# EAGLE design Adafruit_BNO08x (EAGLE 9.6.2)
COMPANY: ADAFRUIT INDUSTRIES; DRAWN: KTOWN; REV: A
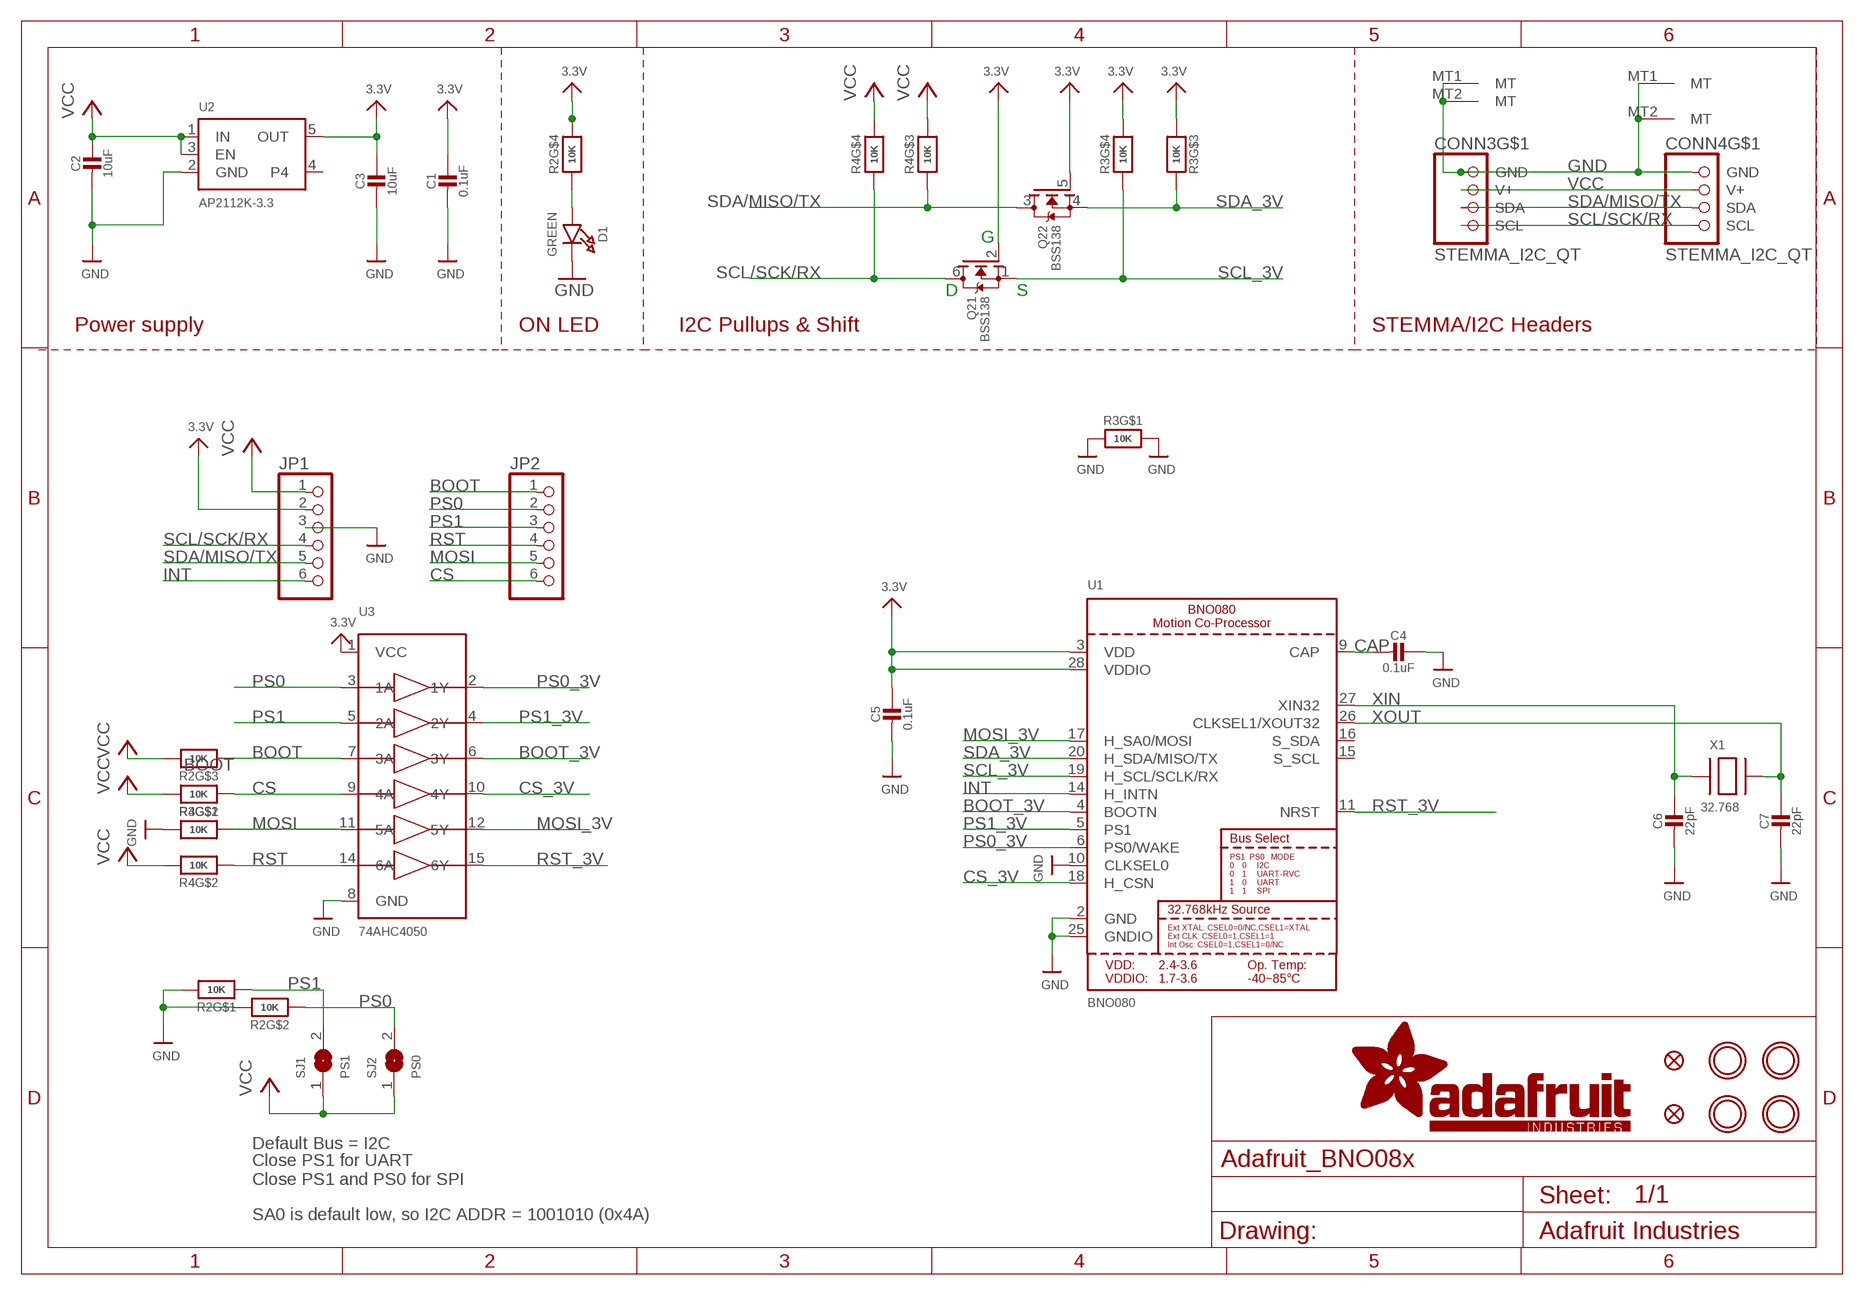
[diagram p0: schematic, sheet 1]

## Parts
C1  0.1uF  CAP_CERAMIC0603_NO  [0603-NO]
C2  10uF  CAP_CERAMIC0805-NOOUTLINE  [0805-NO]
C3  10uF  CAP_CERAMIC0805-NOOUTLINE  [0805-NO]
C4  0.1uF  CAP_CERAMIC0603_NO  [0603-NO]
C5  0.1uF  CAP_CERAMIC0603_NO  [0603-NO]
C6  22pF  CAP_CERAMIC0603_NO  [0603-NO]
C7  22pF  CAP_CERAMIC0603_NO  [0603-NO]
CONN3  STEMMA_I2C_QT  [JST_SH4]
CONN4  STEMMA_I2C_QT  [JST_SH4]
D1  GREEN  LED0603_NOOUTLINE  [CHIPLED_0603_NOOUTLINE]
FID3  FIDUCIAL_1MM  [FIDUCIAL_1MM]
FID4  FIDUCIAL_1MM  [FIDUCIAL_1MM]
JP1  HEADER-1X670MIL  [1X06_ROUND_70]
JP2  HEADER-1X670MIL  [1X06_ROUND_70]
Q2  BSS138  MOSFET-N_DUAL  [SOT363]
R2  10K  RESISTOR_4PACK  [RESPACK_4X0603]
R3  10K  RESISTOR_4PACK  [RESPACK_4X0603]
R4  10K  RESISTOR_4PACK  [RESPACK_4X0603]
SJ1  PS1  SOLDERJUMPER  [SOLDERJUMPER_ARROW_NOPASTE]
SJ2  PS0  SOLDERJUMPER  [SOLDERJUMPER_ARROW_NOPASTE]
U1  BNO080  [BNO080]
U2  AP2112K-3.3  VREG_SOT23-5  [SOT23-5]
U3  74AHC4050  74HC4050DTSSOP  [TSSOP16]
U$1  MOUNTINGHOLE2.5  [MOUNTINGHOLE_2.5_PLATED]
U$17  MOUNTINGHOLE2.5  [MOUNTINGHOLE_2.5_PLATED]
U$19  MOUNTINGHOLE2.5  [MOUNTINGHOLE_2.5_PLATED]
U$21  MOUNTINGHOLE2.5  [MOUNTINGHOLE_2.5_PLATED]
X1  32.768  XTAL-3.2X1.5  [XTAL3215]

## Nets
3.3V [lowpower]: C1.1 C3.1 C5.1 JP1.2 Q2.2(1:G) Q2.5(2:G) R2.5 R3.3 R3.5 U1.3(VDD) U1.28(VDDIO) U2.5(OUT) U3.1(VCC)
BOOT: JP2.1 R2.3 U3.7(3A)
BOOT_3V: U1.4(BOOTN) U3.6(3Y)
CAP: C4.2 U1.9(CAP)
CS: JP2.6 R4.1 U3.9(4A)
CS_3V: U1.18(H_CSN) U3.10(4Y)
GND [lowpower]: C1.2 C2.2 C3.2 C4.1 C5.2 C6.2 C7.2 CONN3.1(GND) CONN3.MT1(MT) CONN3.MT2(MT) CONN4.1(GND) CONN4.MT1(MT) CONN4.MT2(MT) D1.C JP1.3 R2.7 R2.8 R3.1 R3.2 R3.8 U1.2(GND) U1.10(CLKSEL0) U1.25(GNDIO) U2.2(GND) U3.8(GND)
INT: JP1.6 U1.14(H_INTN)
MOSI: JP2.5 R3.7 U3.11(5A)
MOSI_3V: U1.17(H_SA0/MOSI) U3.12(5Y)
N$1: D1.A R2.4
PS0: JP2.2 R2.2 SJ2.2 U3.3(1A)
PS0_3V: U1.6(PS0/WAKE) U3.2(1Y)
PS1: JP2.3 R2.1 SJ1.2 U3.5(2A)
PS1_3V: U1.5(PS1) U3.4(2Y)
RST: JP2.4 R4.2 U3.14(6A)
RST_3V: U1.11(NRST) U3.15(6Y)
SCL/SCK/RX: CONN3.4(SCL) CONN4.4(SCL) JP1.4 Q2.6(1:D) R4.4
SCL_3V: Q2.1(1:S) R3.4 U1.19(H_SCL/SCLK/RX)
SDA/MISO/TX: CONN3.3(SDA) CONN4.3(SDA) JP1.5 Q2.3(2:D) R4.3
SDA_3V: Q2.4(2:S) R3.6 U1.20(H_SDA/MISO/TX)
VCC [lowpower]: C2.1 CONN3.2(V+) CONN4.2(V+) JP1.1 R2.6 R4.5 R4.6 R4.7 R4.8 SJ1.1 SJ2.1 U2.1(IN) U2.3(EN)
XIN: C6.1 U1.27(XIN32) X1.P$1
XOUT: C7.1 U1.26(CLKSEL1/XOUT32) X1.P$2
Unconnected: U1.15(S_SCL) U1.16(S_SDA) U2.4

## Notes on the sheet
- G
- D | S
- Power supply | ON LED | I2C Pullups & Shift | STEMMA/I2C Headers
- Default Bus = I2C
- Close PS1 for UART
  Close PS1 and PS0 for SPI
- SA0 is default low, so I2C ADDR = 1001010 (0x4A)

## Library data of the parts
C1-C7 = microbuilder:CAP_CERAMIC: Ceramic Capacitors For new designs, use the packages preceded by an '_' character since they are more reliable: The following footprints should be used on most boards: _0402 - Standard footprint for regular board layouts _0603 - Standard footprint for regular board layouts _0805 - Standard footprint for regular board layouts _1206 - Standard footprint for regular board layouts For extremely tight-pitch boards where space is at a premium, the following 'micro-pitch' footprints can be used (smaller pads, no silkscreen outline, etc.): _0402MP - Micro-pitch footprint for very dense/compact boards _0603MP - Micro-pitch footprint for very dense/compact boards _0805MP - Micro-pitch footprint for very dense/compact boards _1206MP - Micro-pitch footprint for very dense/compact boards
CONN3 CONN4 = microbuilder:STEMMA_I2C
D1 = microbuilder:LED: LED 0603 - 0603 Surface Mount Package 2mA: Green LED - Low Power (3.9mcd, 2ma, 1.7Vf) - Digikey: 475-2709-2-ND Orange LED - Low Power (9.8mcd, 2ma, 1.8Vf) - Digikey: 475-1194-2-ND Red LED - Low Power (5mcd, 2ma, 1.8Vf) - Digikey: 475-1195-2-ND Yellow LED - Low Power (7mcd, 2ma, 1.8Vf) - Digikey: 475-1196-2-ND 5mA: Blue LED - Low Power (17mcd, 5ma, 2.9Vf) - Digikey: LNJ937W8CRACT-ND 0805 - 0805 Surface Mount Package 2mA: Red LED (8.8mcd, 2mA, 1.8Vf, Clear) - Low Power [Digikey: 475-2510-1-ND] Green LED (5mcd, 2mA, 1.8Vf, Clear) - Low Power [Digikey: 475-2730-1-ND] Yellow LED (11.3mcd, 2mA, 1.8Vf, Clear) - Low Power [Digikey: 475-2555-1-ND] 20mA: Red LED (104mcd, 20mA, Diffused) - LS R976 [Digikey: 475-1278-6-ND] Red LED (12mcd, 20mA, 2.0Vf, Clear) - APT2012EC [Digikey: 754-1128-1-ND] Green LED (15mcd, 20mA, 2.2Vf, Clear) - APT2012GC [Digikey: 754-1131-1-ND] Orange LED (160mcd, 20mA, 2.1Vf, Clear) - APT2012SECK [Digikey: 754-1130-1-ND] 1206 - 1206 Surface Mount Package Green LED (26mcd, 20mA, Diffused) - LG N971 [Digikey: 475-1407-6-ND] Red LED (15mcd, 20mA, Diffused) - LH N974 [Digikey: 475-1416-6-ND] Cree - Cree High-Power Surface Mount LEDs XPEBWT-L1-0000-00D50 - White 111lm 350mA 2.9Vf 6200K 110° XTEAWT-00-0000-00000LEE3 - White 114lm 350mA 2.85Vf 5000K 115° Everlight - Everlight 45-21 Series Surface Mount LEDs 45-21/QK2C-B2832AC2CB2/2T - Warm White 2000mcd 20mA 3.25Vf 3050K 120° 45-21/LK2C-B38452C4CB2/2T - Nuetral White 2000mcd 20mA 3.25Vf 4150K 120° 45-21/LK2C-B50634C6CB2/2T - Cold White 2200mcd 20mA 3.25Vf 5650K 120° PLCC2 Reverse Mount LS T77K-J1L2-1-0-2-R18-Z - Red 11.25mcd 2mA 1.8Vf 630nm 120° LO T77K-L1M2-24-Z - Orange 19.6mcd 2mA 1.8Vf 606nm 120° LY T77K-K2M1-26-Z - Yellow 15.7mcd 2mA 1.8Vf 587nm 120°
FID3 FID4 = microbuilder:FIDUCIAL: Fiducial Alignment Points Various fiducial points for machine vision alignment.; BOM: EXCLUDE
JP1 JP2 = microbuilder:HEADER-1X6: PIN HEADER
Q2 = microbuilder:MOSFET-N_DUAL: Dual N-Channel MOSFET SOT363 (2.0x1.25mm) 2N7002PS - 60V, 320mA [Digikey: 568-5984-1-ND]
R2-R4 = microbuilder:RESISTOR_4PACK: Resistor Packs (4 resistors) 4 x 0603 10K 1/16W - Digikey: YC164J-10KCT-ND
SJ1 SJ2 = microbuilder:SOLDERJUMPER: SMD Solder JUMPER Solder the two pads together to create a connection, or remove the solder to break it. REFLOW - Use this footprint for solder paste and reflow ovens. WAVE - Use this footprint for hand-soldering (larger pads). CLOSED - Has a trace between the two pads to ensure it is closed by default. The trace needs to be cut to disable the jumper, and can be closed again by creating a solder bridge between the two pads.; BOM: EXCLUDE
U1 = microbuilder:BNO080: BNO080 - Motion Co-Processor
U2 = microbuilder:VREG_SOT23-5: SOT23-5 Fixed Voltage Regulators Part Current Out V Out V In V Dropout θJA (°C/W) TJ (°C) Digikey Part No. ADP121 150mA 3.3V 3.4-5.5V 0.09V @ 150mA -- -- ADP121-AUJZ33R7CT-ND ADP121 150mA 3.0V 3.1-5.5V 0.09V @ 150mA -- -- ADP121-AUJZ30R7CT-ND ADP122 300mA 3.3V 3.4-5.5V 0.085V @ 300mA -- -- ADP122AUJZ-3.3-R7CT-ND ADP1712 300mA 3.3V 3.5-5.5V 0.17V @ 300mA -- -- ADP1712AUJZ-3.3-R7TR-ND AP7311 (Low Cost) 150mA 3.3V 3.5-6V 0.15V @ 150mA -- -- AP7311-33WG-7DICT-ND LD39015M18R 150mA 1.8V 1.9V-5.5V 0.08V @ 100mA -- -- 497-6977-1-ND LP2985A-33DBVR 150mA 3.3V 3.3-16V 0.28V @ 150mA 206 150 296-18479-1-ND MCP1824T-3302E/OT 300mA 3.3V 3.5V-6V 0.2V @ 300mA -- -- MCP1824T-3302E/OTCT-ND MIC5205-2.5YM5 TR 150mA 2.5V 2.7-16V 0.165V @ 150mA -- -- 576-1257-2-ND MIC5205-3.0YM5 TR 150mA 3.0V 3.2V-16V 0.165V @ 150mA -- -- 576-1258-2-ND MIC5205-3.3YM5 TR 150mA 3.3V 3.5V-16V 0.165V @ 150mA -- -- 576-1259-2-ND TPS780330220 150mA 3.3V+2.2V 3.6-5.5V 250mV Max -- -- 296-23332-1-ND TDA3663/N1,135 100mA 3.3V 3.5-45V 0.18V @ 50mA -- -- 568-5343-1-ND Max operating temp can be calculated using θJA, TJ (max junction temperature), and power in watts. Set the "Maximum Ambient Temperature" until it reaches TJ ("Max Junction Temperature"), which is the absolute limit for safe use of the regulator: Heat Sink Temperature Calculator <http://www.daycounter.com/Calculators/Heat-Sink-Temperature-Calculator.phtml> For example, With 12V source into a 3.3V LP2985 and a 30mA load, we are dissipating (12V-3.3V) * 0.03A = 0.261W. With a θJA of 206 °C/W, a TJ of 150°C, and 261mW we can safely use the chip without a heat sink up to 75°C (=147.1°C Junction Temperature).
U3 = microbuilder:74HC4050D: 6-channel level shifter 74HC4050D - 2V-6V Supply SOIC16 Digikey: 74HC4050D,653-ND Mouser: 771-74HC4050D-T TSSOP16 Digikey: 296-9215-1-ND Mouser:
U$1 U$17 U$19 U$21 = microbuilder:MOUNTINGHOLE: Mounting Hole For #2 screws (0.086"/2.18mm width, 0.094"/2.4mm hole) use 2.5mm; BOM: EXCLUDE
X1 = adafruit2:XTAL: Low cost SMT crystals, no capacitors included http://www.ladyada.net/library/eagle

## Net classes
1 highpower: width 0.406 mm, drill 0.483 mm
2 lowpower: width 0.254 mm, drill 0.381 mm

## Board
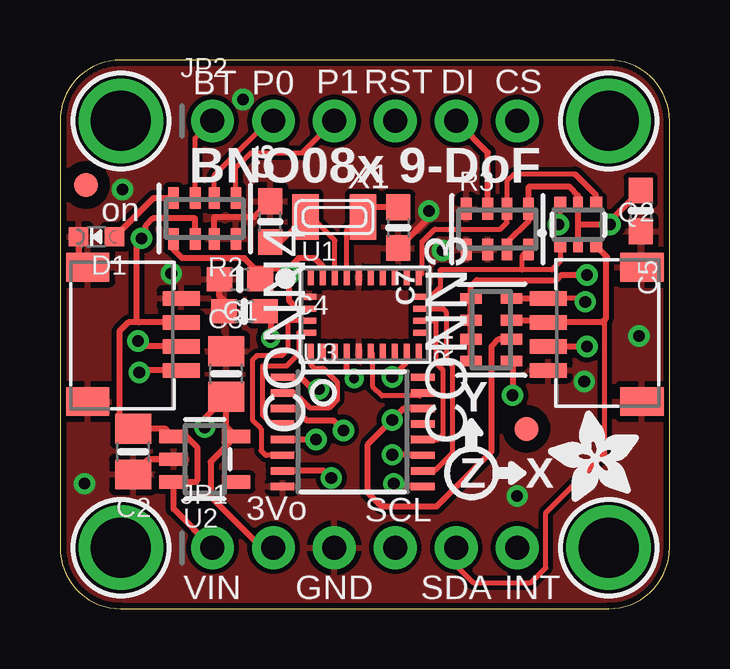
[diagram p1: board, top side]
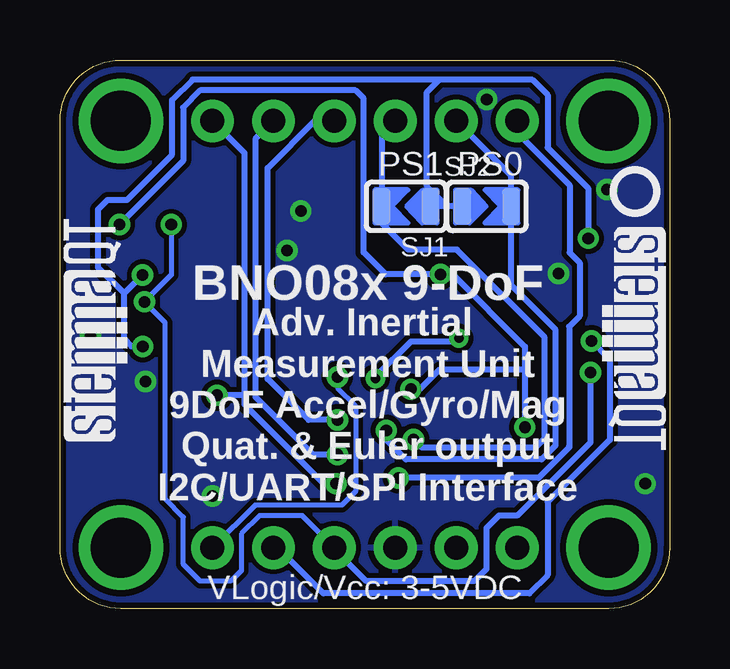
[diagram p2: board, bottom side, seen from below]

Size 25.4 x 22.86 mm. Coordinates in mm from the lower left corner, seen from the top.
Outline: 0,20.32 0,2.54 arc90 2.54,0 22.86,0 arc90 25.4,2.54 25.4,20.32 arc90 22.86,22.86 2.54,22.86 arc90 0,20.32
Copper layers (1*16): Top 0.035mm / dielectric 1.5mm / Bottom 0.035mm
Design rules "adafruit *": minimum track width 8mil, minimum drill 15.5mil, track to track 8mil, track to pad 8mil, pad to pad 8mil, via to via 8mil, smd to smd 8mil, copper to edge 10mil, drill to drill 8mil, minimum pad ring 10mil, minimum via ring 8mil, stop-mask expansion 2mil, vias tented up to drill 20mil, thermal gap 10mil

### Footprints (pad centres in the part's own frame; a part is rotated, then mirrored left to right if it is on the bottom)
0603-NO = smd 1.075 x 1: 1 -0.85,0; 2 0.85,0
0805-NO = smd 1.24 x 1.5: 1 -0.95,0; 2 0.95,0
JST_SH4 = smd 0.6 x 1.55: 1 -1.5,2.514; 2 -0.5,2.514; 3 0.5,2.514; 4 1.5,2.514 | smd 1.2 x 1.8: MT1 -2.8,-1.386; MT2 2.8,-1.386
CHIPLED_0603_NOOUTLINE = smd 0.8 x 0.8: A 0,-0.75; C 0,0.75
FIDUCIAL_1MM = smd 1 x 1: 1 0,0
1X06_ROUND_70 = drill 1 pad 1.778: 1 -6.35,0; 2 -3.81,0; 3 -1.27,0; 4 1.27,0; 5 3.81,0; 6 6.35,0
SOT363 = smd 0.5 x 0.5: 1 -0.75,-0.9; 3 0.75,-0.9; 4 0.75,0.9; 6 -0.75,0.9 | smd 0.4 x 0.5: 2 0,-0.9; 5 0,0.9
RESPACK_4X0603 = smd 0.45 x 0.9: 1 -1.3,-0.85; 2 -0.4,-0.85; 3 0.4,-0.85; 4 1.3,-0.85; 5 1.3,0.85; 6 0.4,0.85; 7 -0.4,0.85; 8 -1.3,0.85
SOLDERJUMPER_ARROW_NOPASTE = smd 0.762 x 1.524: 1 -1.016,0; 2 1.016,0
BNO080 = smd 0.25 x 0.675: 1 -2.25,1.562; 6 -2.25,-1.562; 7 -1.75,-1.562; 8 -1.25,-1.562; 9 -0.75,-1.562; 10 -0.25,-1.562; 11 0.25,-1.562; 12 0.75,-1.562; 13 1.25,-1.562; 14 1.75,-1.562; 15 2.25,-1.562; 20 2.25,1.562; 21 1.75,1.562; 22 1.25,1.562; 23 0.75,1.562; 24 0.25,1.562; 25 -0.25,1.562; 26 -0.75,1.562; 27 -1.25,1.562; 28 -1.75,1.562 | smd 0.575 x 0.25: 2 -2.312,0.75; 3 -2.312,0.25; 4 -2.312,-0.25; 5 -2.312,-0.75; 16 2.312,-0.75; 17 2.312,-0.25; 18 2.312,0.25; 19 2.312,0.75
SOT23-5 = smd 0.55 x 1.2: 1 -0.95,-1.3; 2 0,-1.3; 3 0.95,-1.3; 4 0.95,1.3; 5 -0.95,1.3
TSSOP16 = smd 0.305 x 0.991: 1 -2.275,-2.918; 2 -1.625,-2.918; 3 -0.975,-2.918; 4 -0.325,-2.918; 5 0.325,-2.918; 6 0.975,-2.918; 7 1.625,-2.918; 8 2.275,-2.918; 9 2.275,2.918; 10 1.625,2.918; 11 0.975,2.918; 12 0.325,2.918; 13 -0.325,2.918; 14 -0.975,2.918; 15 -1.625,2.918; 16 -2.275,2.918
MOUNTINGHOLE_2.5_PLATED = drill 2.5 pad 3.2: P$1 0,0
XTAL3215 = smd 1.1 x 1.9: P$1 1.2,0; P$2 -1.2,0

### Placement (x,y rotation side)
C1  7.49,13.72 180 top
C2  3.05,6.54 270 top
C3  6.92,9.78 90 top
C4  7.68,12.38 0 top
C5  24.19,16.57 270 top
C6  8.76,16.13 90 top
C7  14.1,15.88 270 top
CONN3  22.86,11.43 90 top
CONN4  2.54,11.43 270 top
D1  1.52,15.49 90 top
FID3  1.08,17.65 0 top
FID4  19.43,7.49 0 top
JP1  12.7,2.54 0 top
JP2  12.7,20.32 0 top
Q2  21.59,16 0 top
R2  6.03,16.26 180 top
R3  18.22,15.81 0 top
R4  17.97,11.62 90 top
SJ1  10.99,16.76 180 bottom
SJ2  7.62,16.76 0 bottom
U1  12.7,12.26 0 top
U2  6.03,6.22 270 top
U3  12.19,7.37 270 top
U$1  2.54,20.32 0 top
U$17  22.86,20.32 0 top
U$19  2.54,2.54 0 top
U$21  22.86,2.54 0 top
U$22  [ADAFRUIT_3.5MM]  24.13,4.45 90 top
U$25  [PCBFEAT-REV-040]  1.45,17.37 0 bottom
U$30  [STEMMAQT]  22.61,6.99 90 bottom
U$31  [STEMMAQT]  2.79,15.88 270 bottom
X1  11.43,16.32 180 top

### Tracks (layer width: path | path; a pad name or v marks a point on that pad's centre or on a via)
3.3V  (via drill 0.48)
  Top 0.254: U1.3 9.88,12.51 9.55,12.84 v9.55,13.93 9.27,13.93 9.53,14.19 | U1.28 10.95,14.26 10.6,14.61 9.95,14.61 9.53,14.19 | v10.78,9.14 10.53,9.14 10.04,9.64 U3.1 | v6.03,7.56 6.03,7.94 C3.1 6.92,7.58 U2.5 6.28,6.12 6.28,4.67 8.41,2.54 JP1.2 | R2.5 4.73,14.96 5.09,14.61 7.68,14.61 8.1,14.19 8.81,14.19 | Q2.2 21.59,16.07 | 21.59,16.07 Q2.5 21.59,17.21 21.21,17.59 19.56,17.59 19.52,17.56 R3.5 19.52,16.16 18.62,15.26 R3.3 | 21.59,16.07 21.65,16 v22.92,16 22.92,16.15 C5.1 | C1.1 8.81,14.19 | 8.81,14.19 9.53,14.19
  Bottom 0.254: v10.78,9.14 10.4,9.14 9.58,9.97 6.03,9.97 | v22.92,16 20.27,18.66 20.27,20.88 19.56,21.59 13.08,21.59 12.75,21.26 12.75,14.85 11.84,13.93 v9.55,13.93 9.04,13.93 6.03,10.92 6.03,9.97 | 6.03,9.97 v6.03,7.56
BOOT  (via drill 0.48)
  Top 0.203: R2.3 5.63,19.6 JP2.1
  Top 0.254: v11.3,5.45 11.01,5.74 U3.7
  Bottom 0.254: JP2.1 6.35,19.84 4.17,17.65 4.17,14.83 3.75,14.41 3.75,12.19 4.19,11.75 4.19,6.77 4.17,6.75 5.46,5.45 v11.3,5.45
BOOT_3V
  Top 0.203: U3.6 8.58,6.39 8.38,6.58 8.38,7.49 8.04,7.84 8.04,10.39 8.2,10.54 9.24,10.54 9.5,10.8 9.5,11.94 9.56,12.01 U1.4
CAP  (via drill 0.39)
  Top 0.254: C4.2 8.78,12.14 v8.78,11.27 | v12.26,9.59 11.95,9.89 U1.9
  Bottom 0.254: v8.78,11.27 8.91,11.14 10.77,11.14 12.26,9.65 v12.26,9.59
CS  (via drill 0.48)
  Top 0.254: U3.9 14.02,5.09 v13.91,5.21 | R4.1 18.86,10.28 v18.86,8.89
  Bottom 0.254: v13.91,5.21 14.41,5.21 17.65,8.45 17.65,8.51 17.72,8.51 17.72,8.89 | JP2.6 17.72,18.99 17.72,8.89 | 17.72,8.89 v18.86,8.89
CS_3V
  Top 0.203: U1.18 15.96,12.51 16.09,12.38 16.09,10.38 16.34,10.12 16.34,6.48 15.61,5.74 U3.10
GND  (via drill 0.48)
  Top 0.254: U2.2 3.68,6.22 C2.2 | C4.1 6.83,12.85 6.64,13.04 C1.2 | D1.C 0.77,14.61 CONN4.MT1 | C7.2 15.37,16.3 v15.37,16.57 | R2.7 6.43,16.32 8.1,16.32 C6.2
  other vias: 1.02,5.21 19.05,4.7 24.13,11.37 2.6,17.46 4.64,13.97 15.94,14.92 7.62,21.21 21.84,9.46
  pour Top: 0,22.86 0,0 25.4,0 25.4,22.86
  pour Bottom: 0,22.86 0,0 25.4,0 25.4,22.86
INT  (via drill 0.48)
  Top 0.203: U1.14 14.45,10.26 v13.84,9.65
  Bottom 0.203: v13.84,9.65 13.84,9.21 13.08,8.45 13.08,4.89 13.65,4.32 17.27,4.32 JP1.6
MOSI  (via drill 0.48)
  Top 0.203: 16.61,20.22 JP2.5
  Top 0.254: U3.11 15.09,6.41 v13.84,6.41 | R3.7 17.82,19.01 16.61,20.22
  Bottom 0.254: v13.84,6.41 14.85,6.41 17.26,8.83 17.26,19.57 JP2.5
MOSI_3V
  Top 0.203: U1.17 15.65,12.01 15.65,10.25 15.94,9.96 15.94,7.24 15.74,7.04 U3.12
N$1
  Top 0.254: R2.4 3.89,17.11 D1.A
PS0  (via drill 0.48)
  Top 0.203: R2.2 6.43,18.06 7.77,19.39 8.7,20.32 JP2.2
  Top 0.254: v11.81,7.43 11.4,7.83 10.29,7.83 9.78,8.34 U3.3
  Bottom 0.254: v11.81,7.43 11.81,7.04 10.99,6.22 5.33,6.22 4.75,6.81 4.75,11.62 6.6,13.47 SJ2.2 6.6,18.03 JP2.2
PS0_3V
  Top 0.203: U3.2 9.78,8.99 10.42,8.36 11.21,8.36 11.56,8.7 11.56,9.43 10.97,10.02 10.6,10.02 10.45,10.17 U1.6
PS1  (via drill 0.48)
  Top 0.203: R2.1 7.33,18.38 7.94,18.99 10.1,18.99 JP2.3
  Top 0.254: v10.67,7.05 v10.66,7.04 U3.5
  Bottom 0.254: v10.67,7.05 10.35,6.73 5.57,6.73 5.21,7.1 5.21,11.3 8.86,14.96 10.89,14.96 12,16.07 SJ1.2 12,19.75 JP2.3
PS1_3V
  Top 0.203: U3.4 8.82,7.69 8.45,8.06 8.45,10.11 9.44,10.11 9.94,10.62 9.94,11.51 U1.5
RST  (via drill 0.48)
  Top 0.254: U3.14 14.32,8.34 v13.84,7.86 12.83,6.84 12.83,4.83 13.4,4.25 15.68,4.25 17.97,6.54 17.97,10.92 18.27,11.22 R4.2
  Bottom 0.254: v13.84,7.86 15.04,7.86 16.75,9.57 16.75,18.35 14.79,20.32 JP2.4
RST_3V
  Top 0.203: U1.11 13.01,10.63 13.01,9.28 13.43,8.86 14.98,8.86 U3.15
SCL/SCK/RX  (via drill 0.48)
  Top 0.203: 20.13,12.93 CONN3.4 21.74,12.93 v21.89,12.79 | Q2.6 20.83,16.89 20.83,16.07 v20.77,16
  Top 0.254: R4.4 20.13,12.93 | CONN4.4 3.39,9.93 v3.3,9.84
  Bottom 0.203: v20.77,16 20.77,13.91 v21.89,12.79 21.02,11.92 21.02,4.57 20.26,3.81 20.26,1.84 19.56,1.14 18.29,1.14 17.84,1.59 17.84,3.11 17.08,3.87 15.3,3.87 JP1.4
  Bottom 0.254: JP1.4 13.97,2.48 12.64,1.14 8.14,1.14 7.63,1.65 7.63,3.35 7.11,3.87 6.35,3.87 3.3,6.92 v3.3,9.84
SCL_3V
  Top 0.203: U1.19 15.46,13.01 15.84,13.39 15.84,14.12 19.24,14.12 | Q2.1 20.84,14.47 20.49,14.12 19.24,14.12 | R3.4 19.24,14.68 19.24,14.12
SDA/MISO/TX  (via drill 0.48)
  Top 0.203: JP1.5 16.51,1.78 17.21,1.08 19.62,1.08 20.24,1.7 20.24,3.99 22.7,6.45 22.7,12.03
  Top 0.254: Q2.3 22.79,14.66 22.73,14.66 22.73,12.06 22.7,12.03 22.6,11.93 CONN3.3 20.26,12.02 R4.3 | CONN4.3 3.48,10.93 v3.25,11.15
  Bottom 0.254: v3.25,11.15 2.49,10.39 2.49,7.04 5.08,4.45 5.08,1.4 5.84,0.64 14.42,0.64 16.33,2.54 JP1.5
SDA_3V
  Top 0.203: U1.20 15.08,13.95 15.08,15.27 15.62,15.81 18.35,15.81 18.62,16.08 R3.6 18.62,17.8 18.92,18.1 21.46,18.1
  Top 0.254: Q2.4 22.34,17.22 21.46,18.1
VCC  (via drill 0.48)
  Top 0.254: CONN4.2 3.3,11.93 | 3.3,11.93 2.85,11.93 2.48,11.56 2.48,8.06 C2.1 4.42,7.49 U2.1 5.27,7.17 5.71,6.73 5.71,5.34 5.65,5.27 U2.3 4.73,4.16 JP1.1 | R4.8 R4.7 R4.6 R4.5 17.12,13.44 17.37,13.69 20.67,13.69 20.89,13.91 v21.96,13.91 | R2.6 5.63,16.26 3.87,16.26 3.58,15.96 3.58,15.62 v3.39,15.43 3.17,15.21 3.17,12.06 3.3,11.93 | CONN3.2 v21.94,10.93 v21.95,10.92
  Bottom 0.254: v21.96,13.91 22.73,13.13 | 22.73,13.13 22.73,11.24 22.42,10.92 v21.95,10.92 | SJ2.1 9.27,16.76 | 9.27,16.76 SJ1.1 | 9.27,16.76 10.11,17.6 10.11,21.52 9.6,22.04 | v3.39,15.43 3.39,17.52 5.08,19.21 5.08,21.41 5.71,22.04 9.6,22.04 | 9.6,22.04 9.59,22.05 19.87,22.05 20.73,21.2 20.73,18.91 22.61,17.03 23.42,17.03 23.81,16.64 23.81,14.21 22.73,13.13
XIN
  Top 0.203: U1.27 11.45,15.35 10.48,16.32 X1.P$1 9.19,15.28 C6.1
XOUT
  Top 0.203: U1.26 11.95,15.77 12.38,16.2 12.51,16.2 X1.P$2
  Top 0.254: C7.1 12.91,16.73 12.38,16.2

### Text on the board
tPlace: BT | P0 | P1 | RST | DI | CS | BNO08x 9-DoF | on | Y | X | Z | 3Vo | SCL | VIN | GND | SDA | INT
bPlace: PS0 | PS1 | BNO08x 9-DoF | Adv. Inertial / Measurement Unit / 9DoF Accel/Gyro/Mag / Quat. & Euler output / I2C/UART/SPI Interface | VLogic/Vcc: 3-5VDC